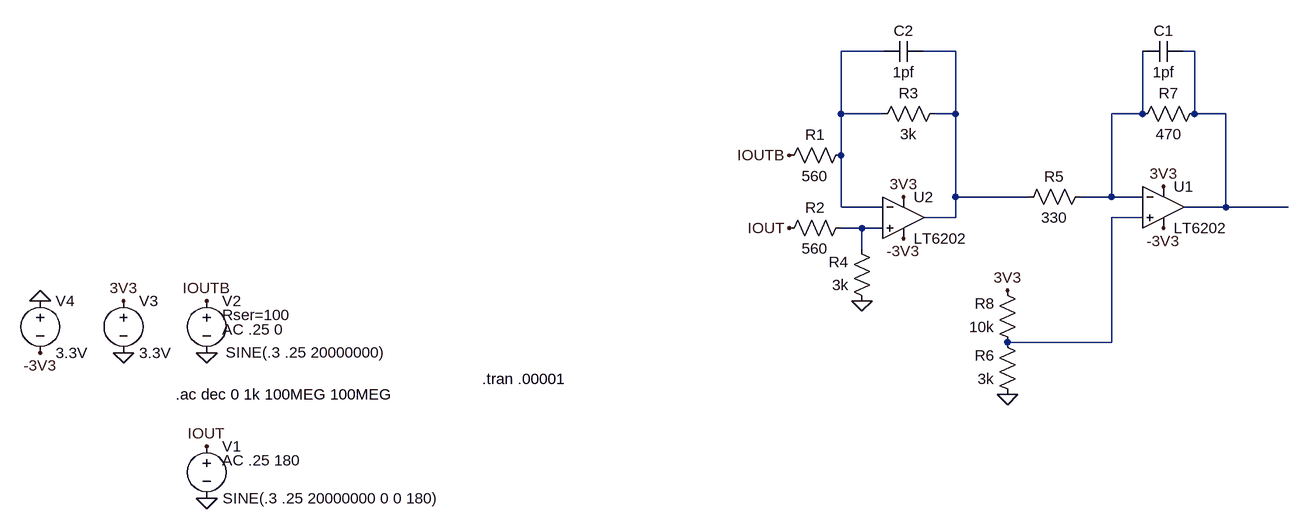
[diagram p0: schematic second test.asc]
second test.asc, the LTspice schematic file:
Version 4
SHEET 1 1700 680
WIRE 1072 -240 1008 -240
WIRE 1184 -240 1136 -240
WIRE 1552 -240 1536 -240
WIRE 1008 -144 1008 -240
WIRE 1072 -144 1008 -144
WIRE 1184 -144 1184 -240
WIRE 1184 -144 1152 -144
WIRE 1472 -144 1472 -240
WIRE 1472 -144 1424 -144
WIRE 1552 -144 1552 -240
WIRE 1600 -144 1552 -144
WIRE 1008 -80 1008 -144
WIRE 1184 -16 1184 -144
WIRE 1296 -16 1184 -16
WIRE 1424 -16 1424 -144
WIRE 1424 -16 1376 -16
WIRE 1472 -16 1424 -16
WIRE 1008 0 1008 -80
WIRE 1072 0 1008 0
WIRE 1600 0 1600 -144
WIRE 1600 0 1536 0
WIRE 1696 0 1600 0
WIRE 1184 16 1184 -16
WIRE 1184 16 1136 16
WIRE 1472 16 1424 16
WIRE 1040 32 1008 32
WIRE 1072 32 1040 32
WIRE 1040 64 1040 32
WIRE 1424 208 1424 16
WIRE 1424 208 1264 208
FLAG 32 448 0
FLAG 32 224 0
FLAG -96 224 0
FLAG 32 368 IOUT
FLAG 32 144 IOUTB
FLAG -96 144 3V3
FLAG 928 -80 IOUTB
FLAG 1104 -16 3V3
FLAG 928 32 IOUT
FLAG -224 144 0
FLAG -224 224 -3V3
FLAG 1040 144 0
FLAG 1104 48 -3V3
FLAG 1504 -32 3V3
FLAG 1504 32 -3V3
FLAG 1264 128 3V3
FLAG 1264 288 0
SYMBOL voltage 32 352 R0
WINDOW 3 192 96 Center 2
WINDOW 123 24 38 Left 2
SYMATTR Value SINE(.3 .25 20000000 0 0 180)
SYMATTR Value2 AC .25 180
SYMATTR InstName V1
SYMATTR SpiceLine Rser=100
SYMBOL voltage 32 128 R0
WINDOW 3 153 111 Bottom 2
WINDOW 39 24 38 Left 2
WINDOW 123 24 60 Left 2
SYMATTR Value SINE(.3 .25 20000000)
SYMATTR SpiceLine Rser=100
SYMATTR Value2 AC .25 0
SYMATTR InstName V2
SYMBOL voltage -96 128 R0
SYMATTR InstName V3
SYMATTR Value 3.3V
SYMATTR SpiceLine Rser=0
SYMBOL res 1024 -96 R90
WINDOW 0 0 56 VBottom 2
WINDOW 3 32 56 VTop 2
SYMATTR InstName R1
SYMATTR Value 560
SYMBOL res 1024 16 R90
WINDOW 0 0 56 VBottom 2
WINDOW 3 32 56 VTop 2
SYMATTR InstName R2
SYMATTR Value 560
SYMBOL voltage -224 128 R0
SYMATTR InstName V4
SYMATTR Value 3.3V
SYMATTR SpiceLine Rser=0
SYMBOL res 1168 -160 R90
WINDOW 0 0 56 VBottom 2
WINDOW 3 32 56 VTop 2
SYMATTR InstName R3
SYMATTR Value 3k
SYMBOL res 1056 160 R180
WINDOW 0 36 76 Left 2
WINDOW 3 36 40 Left 2
SYMATTR InstName R4
SYMATTR Value 3k
SYMBOL res 1392 -32 R90
WINDOW 0 0 56 VBottom 2
WINDOW 3 32 56 VTop 2
SYMATTR InstName R5
SYMATTR Value 330
SYMBOL res 1280 304 R180
WINDOW 0 36 76 Left 2
WINDOW 3 36 40 Left 2
SYMATTR InstName R6
SYMATTR Value 3k
SYMBOL res 1568 -160 R90
WINDOW 0 0 56 VBottom 2
WINDOW 3 32 56 VTop 2
SYMATTR InstName R7
SYMATTR Value 470
SYMBOL cap 1536 -256 R90
WINDOW 0 0 32 VBottom 2
WINDOW 3 32 32 VTop 2
SYMATTR InstName C1
SYMATTR Value 1pf
SYMBOL cap 1136 -256 R90
WINDOW 0 0 32 VBottom 2
WINDOW 3 32 32 VTop 2
SYMATTR InstName C2
SYMATTR Value 1pf
SYMBOL Opamps/LT6202 1504 0 R0
SYMATTR InstName U1
SYMBOL Opamps/LT6202 1104 16 R0
SYMATTR InstName U2
SYMBOL res 1280 224 R180
WINDOW 0 36 76 Left 2
WINDOW 3 36 40 Left 2
SYMATTR InstName R8
SYMATTR Value 10k
TEXT -16 288 Left 2 !.ac dec 0 1k 100MEG 100MEG
TEXT 456 264 Left 2 !.tran .00001

The netlist it stands for:
* second test.asc
V1 IOUT 0 SINE(.3 .25 20000000 0 0 180) AC .25 180 Rser=100
V2 IOUTB 0 SINE(.3 .25 20000000) AC .25 0 Rser=100
V3 3V3 0 3.3V Rser=0
R1 N001 IOUTB 560
R2 N006 IOUT 560
V4 0 -3V3 3.3V Rser=0
R3 N002 N001 3k
R4 0 N006 3k
R5 N004 N002 330
R6 0 N005 3k
R7 N003 N004 470
C1 N003 N004 1pf
C2 N002 N001 1pf
* U1: LT6202 (symbol Opamps/LT6202 not available, pins judged from their places): In+=N005 In-=N004 V+=3V3 V-=-3V3 OUT=N003
* U2: LT6202 (symbol Opamps/LT6202 not available, pins judged from their places): In+=N006 In-=N001 V+=3V3 V-=-3V3 OUT=N002
R8 N005 3V3 10k
.ac dec 0 1k 100MEG 100MEG
.tran .00001
.backanno
.end